# EAGLE design mono2 (EAGLE 5.11)
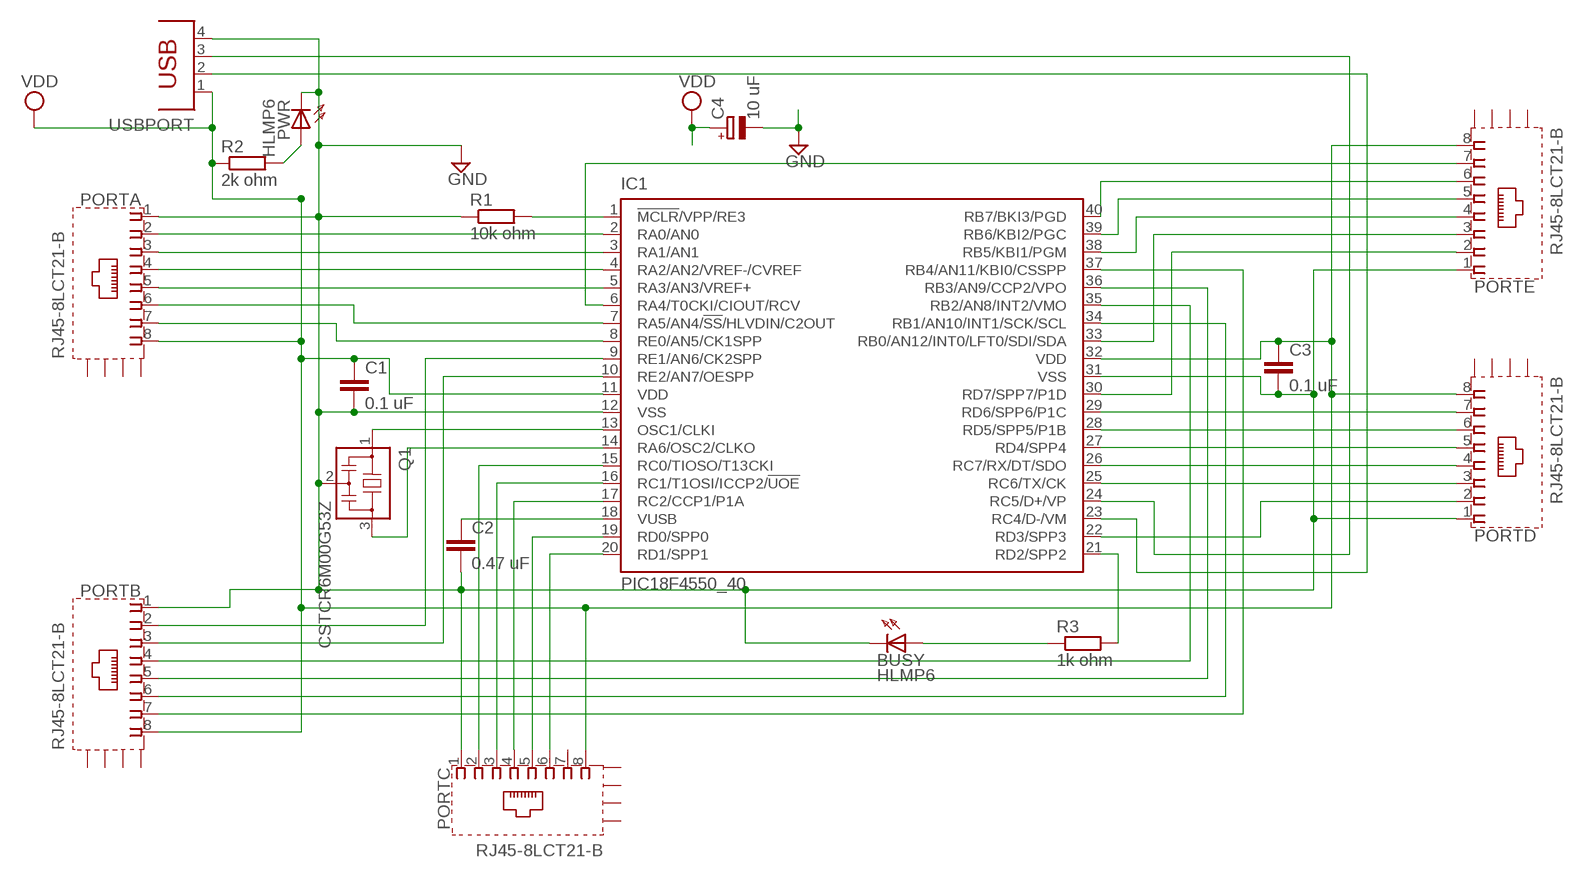
[diagram p0: schematic, sheet 1]

## Parts
BUSY  HLMP6  [HLMP6]
C1  0.1 uF  C5/3  [C5B3]
C2  0.47 uF  C5/3  [C5B3]
C3  0.1 uF  C5/3  [C5B3]
C4  10 uF  CPOL-EUE2.5-6  [E2,5-6]
IC1  PIC18F4550_40  [DIL40]
PORTA  RJ45-8LCT21-B  [RJ45-SHIELD1]
PORTB  RJ45-8LCT21-B  [RJ45-SHIELD1]
PORTC  RJ45-8LCT21-B  [RJ45-SHIELD1]
PORTD  RJ45-8LCT21-B  [RJ45-SHIELD1]
PORTE  RJ45-8LCT21-B  [RJ45-SHIELD1]
PWR  HLMP6  [HLMP6]
Q1  CSTCR6M00G53Z  [CSTCR6M]
R1  10k ohm  R-EU_0207/7  [0207/7]
R2  2k ohm  R-EU_0207/7  [0207/7]
R3  1k ohm  R-EU_0207/7  [0207/7]
USBPORT  PN61729  [PN61729]

## Nets
GND: BUSY.K C1.2 C2.2 C3.2 C4.- IC1.12(VSS) IC1.31(VSS) PORTA.1 PORTB.1 PORTC.1 PORTD.1 PORTE.1 PWR.K Q1.2 R1.1 USBPORT.4
N$1: IC1.2(RA0/AN0) PORTA.2
N$2: IC1.3(RA1/AN1) PORTA.3
N$3 [ad]: IC1.14(RA6/OSC2/CLKO) Q1.3
N$4: IC1.4(RA2/AN2/VREF-/CVREF) PORTA.4
N$5: IC1.5(RA3/AN3/VREF+) PORTA.5
N$6: IC1.29(RD6/SPP6/P1C) PORTD.7
N$7: IC1.1(!MCLR!/VPP/RE3) R1.2
N$8 [ad]: IC1.7(RA5/AN4/!SS!/HLVDIN/C2OUT) PORTA.6
N$9 [ad]: IC1.8(RE0/AN5/CK1SPP) PORTA.7
N$10 [ad]: IC1.9(RE1/AN6/CK2SPP) PORTB.2
N$11 [ad]: IC1.10(RE2/AN7/OESPP) PORTB.3
N$12 [ad]: IC1.37(RB4/AN11/KBI0/CSSPP) PORTB.7
N$14 [ad]: IC1.34(RB1/AN10/INT1/SCK/SCL) PORTB.6
N$15 [ad]: IC1.36(RB3/AN9/CCP2/VPO) PORTB.5
N$16 [ad]: IC1.35(RB2/AN8/INT2/VMO) PORTB.4
N$17: IC1.13(OSC1/CLKI) Q1.1
N$18: IC1.15(RC0/TIOSO/T13CKI) PORTC.2
N$19: IC1.17(RC2/CCP1/P1A) PORTC.4
N$20: IC1.16(RC1/T1OSI/ICCP2/!UOE) PORTC.3
N$21: IC1.20(RD1/SPP1) PORTC.6
N$22: IC1.19(RD0/SPP0) PORTC.5
N$23: C2.1 IC1.18(VUSB)
N$24: IC1.21(RD2/SPP2) R3.2
N$25: IC1.22(RD3/SPP3) PORTD.2
N$26: IC1.28(RD5/SPP5/P1B) PORTD.6
N$27: IC1.26(RC7/RX/DT/SDO) PORTD.4
N$28: IC1.27(RD4/SPP4) PORTD.5
N$29: IC1.25(RC6/TX/CK) PORTD.3
N$30: BUSY.A R3.1
N$31: IC1.30(RD7/SPP7/P1D) PORTE.2
N$32 [ad]: IC1.33(RB0/AN12/INT0/LFT0/SDI/SDA) PORTE.3
N$33: IC1.38(RB5/KBI1/PGM) PORTE.4
N$34: IC1.40(RB7/BKI3/PGD) PORTE.6
N$35: IC1.39(RB6/KBI2/PGC) PORTE.5
N$36: IC1.6(RA4/T0CKI/CIOUT/RCV) PORTE.7
N$37: IC1.23(RC4/D-/VM) USBPORT.2
N$38: IC1.24(RC5/D+/VP) USBPORT.3
N$39: PWR.A R2.2
VDD: C1.1 C3.1 C4.+ IC1.11(VDD) IC1.32(VDD) PORTA.8 PORTB.8 PORTC.8 PORTD.8 PORTE.8 R2.1 USBPORT.1
Unconnected: PORTA.S1(S) PORTA.S2(S) PORTA.S3(S) PORTA.S4(S) PORTB.S1(S) PORTB.S2(S) PORTB.S3(S) PORTB.S4(S) PORTC.7 PORTC.S1(S) PORTC.S2(S) PORTC.S3(S) PORTC.S4(S) PORTD.S1(S) PORTD.S2(S) PORTD.S3(S) PORTD.S4(S) PORTE.S1(S) PORTE.S2(S) PORTE.S3(S) PORTE.S4(S)

## Library data of the parts
BUSY PWR = display-hp:HLMP6: LED 2mm horizontal; MF: AGILENT TECHNOLOGIES; MPN: HLMP-6500; OC_FARNELL: 1652490; OC_NEWARK: 40K0088
C1-C3 = capacitor-wima:C: CAPACITOR naming: grid - package width
C4 = rcl:CPOL-EU: POLARIZED CAPACITOR, European symbol
IC1 = microchip:PIC18F4*_40: USB Microcontrollers with nanoWatt Technology High-Performance, Enhanced Flash, 28/40/44-Pin, Source: http://ww1.microchip.com/downloads/en/devicedoc/39632c.pdf; MF: MICROCHIP; MPN: PIC18F4550-I/P; OC_FARNELL: 9321357; OC_NEWARK: 74K8623
PORTA PORTB PORTC PORTD PORTE = con-tycoelectronics:RJ45*2: RJ45 Low Profile Shield Type 2 For all RJ45 L, LC, LCT and X Series Models Source: www.tycoelectronics.com .. ENG_DS_1654001_1099_RJ_L_0507.pdf; OC_FARNELL: unknown; OC_NEWARK: unknown
Q1 = murata-filter:CSTCR: Resonator Source: murata.co.jp; MPN: CSTCR6M00G53-R0; OC_FARNELL: 1170434; OC_NEWARK: 25M8759
R1 R3 = rcl:R-EU_: RESISTOR, European symbol
R2 = resistor:R-EU_: RESISTOR, European symbol
USBPORT = con-berg:PN61729: BERG USB connector; OC_FARNELL: unknown; OC_NEWARK: unknown

## Net classes
0 default: width 0.203 mm
1 pwr: width 0.203 mm
2 ad: width 0.203 mm

## Board
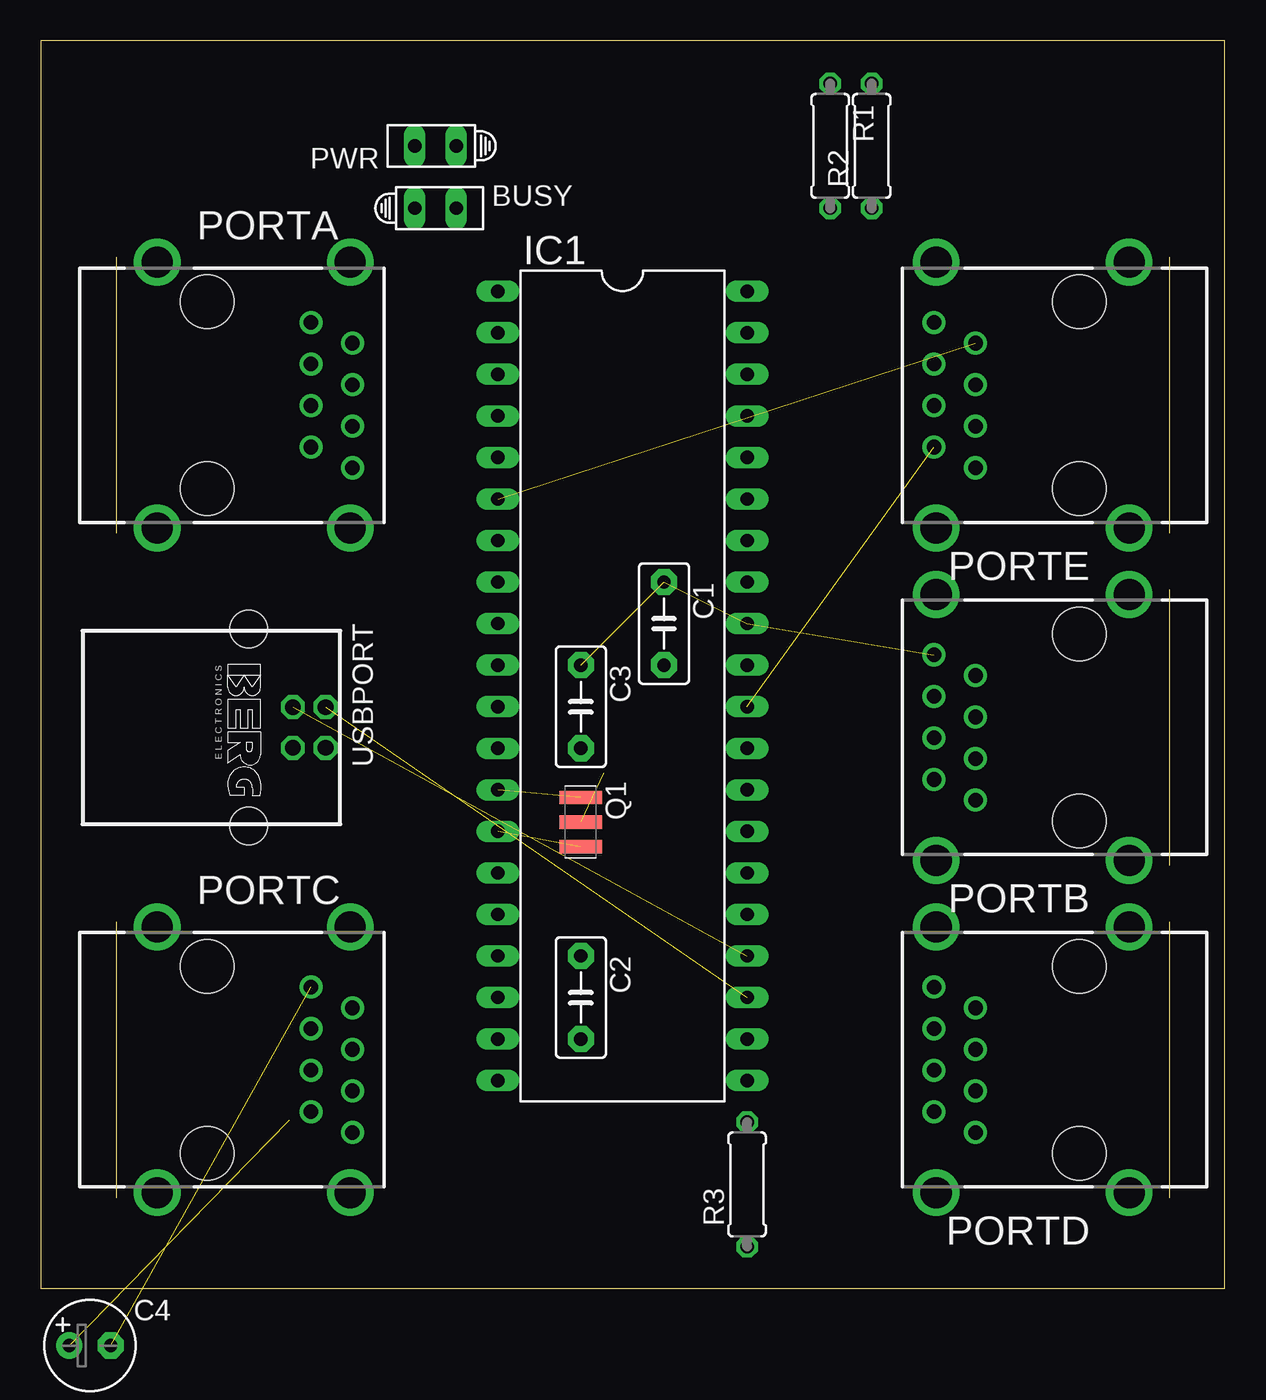
[diagram p1: board, top side]
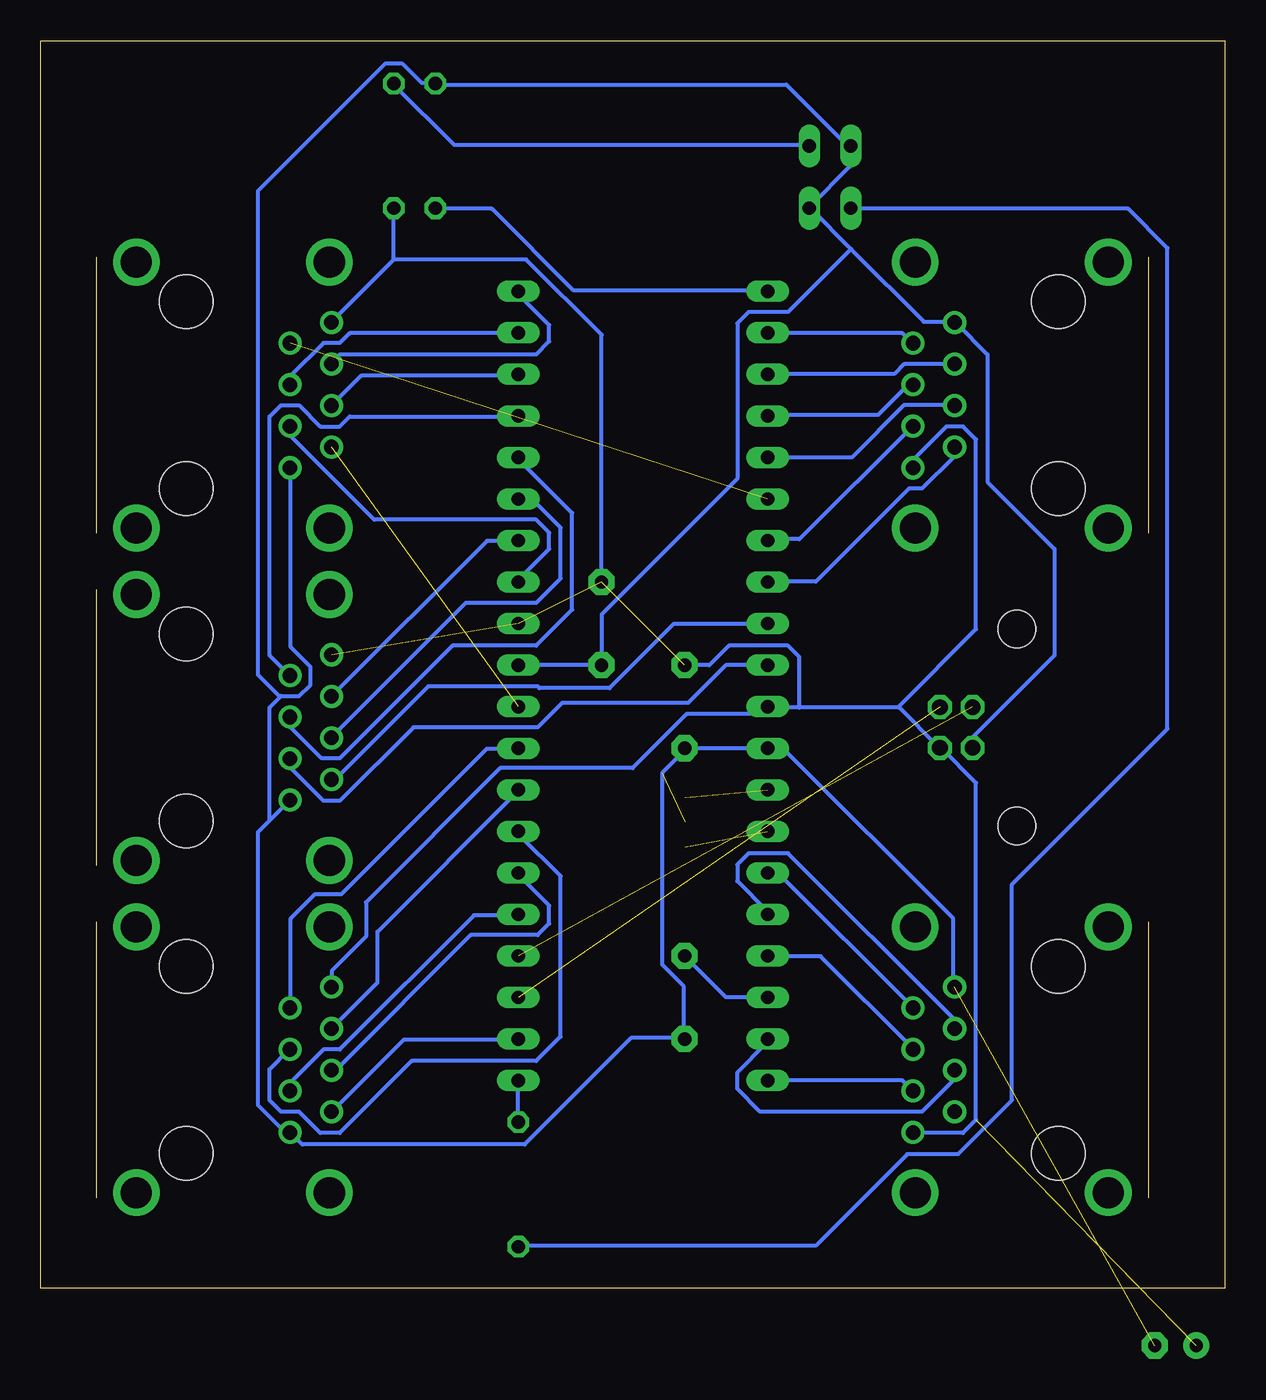
[diagram p2: board, bottom side, seen from below]

Size 72.38 x 76.27 mm. Coordinates in mm from the lower left corner, seen from the top.
Outline: 0,0 72.38,0 72.38,76.27 0,76.27 0,0
Copper layers (1*16): Top 0.035mm / dielectric 1.5mm / Bottom 0.035mm
Design rules "default *": minimum track width 10mil, minimum drill 24mil, track to track 16mil, track to pad 16mil, pad to pad 16mil, via to via 16mil, smd to smd 8mil, copper to edge 40mil, drill to drill 8mil, minimum pad ring 10mil, minimum via ring 8mil, stop-mask expansion 4mil, vias tented up to drill 0mil, thermal gap 10mil

### Footprints (pad centres in the part's own frame; a part is rotated, then mirrored left to right if it is on the bottom)
HLMP6 = drill 0.813 long: A -1.27,0; K 1.27,0
C5B3 = drill 0.813 pad 1.6 octagon: 1 -2.54,0; 2 2.54,0
E2,5-6 = drill 0.813 pad 1.6 round: + -1.27,0 | drill 0.813 pad 1.6 octagon: - 1.27,0
DIL40 = drill 0.813 long: 1 -24.13,-7.62; 2 -21.59,-7.62; 3 -19.05,-7.62; 4 -16.51,-7.62; 5 -13.97,-7.62; 6 -11.43,-7.62; 7 -8.89,-7.62; 8 -6.35,-7.62; 9 -3.81,-7.62; 10 -1.27,-7.62; 11 1.27,-7.62; 12 3.81,-7.62; 13 6.35,-7.62; 14 8.89,-7.62; 15 11.43,-7.62; 16 13.97,-7.62; 17 16.51,-7.62; 18 19.05,-7.62; 19 21.59,-7.62; 20 24.13,-7.62; 21 24.13,7.62; 22 21.59,7.62; 23 19.05,7.62; 24 16.51,7.62; 25 13.97,7.62; 26 11.43,7.62; 27 8.89,7.62; 28 6.35,7.62; 29 3.81,7.62; 30 1.27,7.62; 31 -1.27,7.62; 32 -3.81,7.62; 33 -6.35,7.62; 34 -8.89,7.62; 35 -11.43,7.62; 36 -13.97,7.62; 37 -16.51,7.62; 38 -19.05,7.62; 39 -21.59,7.62; 40 -24.13,7.62
RJ45-SHIELD1 = drill 0.9 pad 1.4 round: 1 -4.445,6.35; 2 -3.175,8.89; 3 -1.905,6.35; 4 -0.635,8.89; 5 0.635,6.35; 6 1.905,8.89; 7 3.175,6.35; 8 4.445,8.89 | drill 1.9 pad 2.5 round: S1 -8.128,-3.048; S2 8.128,-3.048; S3 -8.128,8.76; S4 8.128,8.76 | hole 3.251: -5.715,0; 5.715,0
CSTCR6M = smd 0.8 x 2.6: 1 -1.5,0; 2 0,0; 3 1.5,0
0207/7 = drill 0.813 octagon: 1 -3.81,0; 2 3.81,0
PN61729 = drill 0.95 octagon: 1 1.25,4.71; 2 -1.25,4.71; 3 -1.25,2.71; 4 1.25,2.71 | hole 2.3: -6.02,0; 6.02,0

### Placement (x,y rotation side)
BUSY  24.13,66.04 0 top
C1  38.1,40.64 270 top
C2  33.02,17.78 270 top
C3  33.02,35.56 270 top
C4  3,-3.5 0 top  (outside the outline)
IC1  35.56,36.83 270 top
PORTA  10.16,54.61 270 top
PORTB  63.5,34.29 90 top
PORTC  10.16,13.97 270 top
PORTD  63.5,13.97 90 top
PORTE  63.5,54.61 90 top
PWR  24.13,69.85 180 top
Q1  33,28.5 270 top
R1  48.26,69.85 270 top
R2  50.8,69.85 90 top
R3  43.18,6.35 90 top
USBPORT  12.7,34.29 270 top

### Tracks (layer width: path | path; a pad name or v marks a point on that pad's centre or on a via)
GND  (2 unrouted)
  Bottom 0.254: IC1.31 C1.2 38.1,41.2 29.8,49.5 29.8,59 29.1,59.7 26.7,59.7 22.85,63.55 | 22.85,63.55 25.3,66 BUSY.K 25.4,66.1 22.9,68.6 22.9,69.8 PWR.K 23,69.8 26.8,73.6 48.2,73.6 R1.1 48.3,73.7 49.1,73.7 50.3,74.9 51.3,74.9 59.1,67.1 59.1,37.5 57.8,36.2 57.7,36.2 | 22.85,63.55 18.4,59.1 16.6,59.1 PORTA.1 16.4,59 14.5,57.1 14.5,49.3 10.4,45.2 10.4,38.7 15.4,33.7 15.4,33.1 USBPORT.4 | PORTC.1 16.6,18.5 16.6,22.6 26.9,32.9 27.9,32.9 IC1.12 28,33 33,33 C3.2 33,32.9 34.4,31.5 34.4,19.8 33.1,18.5 33.1,15.3 C2.2 33.2,15.3 36.3,15.3 42.8,8.8 56.4,8.8 57.1,9.5 PORTD.1 57.2,9.6 57.5,9.6 59.1,11.2 59.1,27.9 58.35,28.65 | 58.35,28.65 57.2,29.8 PORTB.1 | 57.7,36.2 56.6,36.2 55.9,36.9 55.9,38 57.1,39.2 57.1,50.1 PORTE.1 | 57.7,36.2 58.4,35.5 58.4,28.7 58.35,28.65
N$1
  Bottom 0.254: IC1.2 27.9,58.4 19.7,58.4 19.1,57.8 PORTA.2
N$2
  Bottom 0.254: IC1.3 27.9,55.9 20.2,55.9 19.6,56.5 16.6,56.5 PORTA.3
N$3  (1 unrouted)
N$4
  Bottom 0.254: IC1.4 27.9,53.4 21.2,53.4 19.4,55.2 19.1,55.2 PORTA.4
N$5
  Bottom 0.254: IC1.5 22.8,50.8 19.6,54 16.6,54 PORTA.5
N$6
  Bottom 0.254: IC1.29 43.2,33 45.1,33 54,24.1 55.6,24.1 57.1,22.6 57.1,17.2 PORTD.7
N$7
  Bottom 0.254: IC1.1 28,61 39.8,61 44.8,66 48.2,66 R1.2
N$8
  Bottom 0.254: IC1.7 27.9,45.8 26,45.8 19.1,52.7 PORTA.6
N$9
  Bottom 0.254: IC1.8 27.9,43.2 25,43.2 19.3,48.9 18.5,48.9 16.6,50.8 16.6,51.4 PORTA.7
N$10
  Bottom 0.254: IC1.9 28,40.6 33.7,40.6 37.6,36.7 41.9,36.7 42,36.8 48.7,36.8 54.3,31.2 54.6,31.2 PORTB.2
N$11
  Bottom 0.254: IC1.10 30.5,38.1 32.8,35.8 40.5,35.8 42,34.3 49.6,34.3 54.1,29.8 55.1,29.8 57.1,31.8 57.1,32.3 PORTB.3
N$12
  Bottom 0.254: IC1.37 43.2,53.3 53.5,53.3 54.1,52.7 55.3,52.7 56.6,54 57.7,54 58.4,53.3 58.4,38.7 57.2,37.5 PORTB.7
N$14
  Bottom 0.254: IC1.34 43.2,45.7 45.1,45.7 PORTB.6
N$15
  Bottom 0.254: IC1.36 43.1,50.8 43.1,50.6 39.9,47.4 39.9,41.5 42.1,39.3 47.2,39.3 54.1,32.4 55.2,32.4 57.1,34.3 57.1,34.9 PORTB.5
N$16
  Bottom 0.254: IC1.35 43.1,48.2 42.3,48.2 40.6,46.5 40.6,43.4 42.1,41.9 46.4,41.9 54.6,33.7 PORTB.4
N$17  (1 unrouted)
N$18
  Bottom 0.254: IC1.15 27.3,25.4 19.1,17.2 PORTC.2
N$19
  Bottom 0.254: IC1.17 27.9,20.3 24.7,20.3 19.1,14.7 PORTC.4
N$20
  Bottom 0.254: IC1.16 28,22.9 28,23.1 29.8,24.9 29.8,25.9 29.1,26.6 26.7,26.6 16.6,16.5 16.6,15.9 PORTC.3
N$21
  Bottom 0.254: IC1.20 19.7,12.7 19.1,12.1 PORTC.6
N$22
  Bottom 0.254: IC1.19 28,15.2 28,15 29.8,13.2 29.8,12.2 28.4,10.8 18.5,10.8 16.6,12.7 16.6,13.3 PORTC.5
N$23
  Bottom 0.254: IC1.18 28,17.8 30.5,17.8 C2.1
N$24
  Bottom 0.254: R3.2 43.2,10.2 43.2,12.7 IC1.21
N$25
  Bottom 0.254: IC1.22 43.2,15.2 50.2,15.2 PORTD.2
N$26
  Bottom 0.254: IC1.28 43.2,30.4 51.8,21.8 51.8,18.7 54.6,15.9 PORTD.6
N$27
  Bottom 0.254: IC1.26 43.1,25.4 43.1,25.2 41.3,23.4 41.3,22.3 42,21.6 46.1,21.6 54.3,13.4 54.6,13.4 PORTD.4
N$28
  Bottom 0.254: IC1.27 43.1,27.9 43.1,27.7 40.6,25.2 40.6,15.4 42.1,13.9 49.7,13.9 54.1,9.5 55.3,9.5 56.6,10.8 57.7,10.8 58.4,11.5 58.4,13.4 57.2,14.6 PORTD.5
N$29
  Bottom 0.254: IC1.25 43.2,22.8 45.9,22.8 54.1,14.6 55.1,14.6 57.1,12.6 57.1,12.1 PORTD.3
N$30
  Bottom 0.254: R3.1 43.1,2.6 25,2.6 19.4,8.2 16.3,8.2 13,11.5 13,24.7 3.5,34.2 3.5,63.6 5.9,66 22.8,66 BUSY.A
N$31  (1 unrouted)
N$32
  Bottom 0.254: IC1.33 43.1,43.2 43.1,43.4 41.3,45.2 41.3,46.2 42.1,47 52,47 57.1,52.1 57.1,52.7 PORTE.3
N$33
  Bottom 0.254: IC1.38 43.2,55.8 52.8,55.8 54.6,54 PORTE.4
N$34
  Bottom 0.254: IC1.40 43.1,60.9 43.1,60.7 41.3,58.9 41.3,57.9 42.1,57.1 54.1,57.1 54.6,56.6 PORTE.6
N$35
  Bottom 0.254: IC1.39 43.2,58.4 53.5,58.4 54.1,57.8 55.1,57.8 57.1,55.8 57.1,55.3 PORTE.5
N$36  (1 unrouted)
N$37  (1 unrouted)
N$38  (1 unrouted)
N$39
  Bottom 0.254: PWR.A 25.4,69.9 47.1,69.9 50.8,73.6 R2.2
VDD  (4 unrouted)
  Bottom 0.254: 50.8,62.9 54.6,59.1 PORTE.8 | 50.8,62.9 R2.1 | C1.1 38.1,58.3 42.7,62.9 50.8,62.9 | 19.9,35.5 26,35.5 | 26,35.5 27.9,35.5 IC1.11 28.4,35.1 32.9,35.1 36.2,31.8 44.3,31.8 52.5,23.6 52.5,21.5 54.6,19.4 54.6,18.5 PORTD.8 | 19.9,35.5 17.5,33.1 USBPORT.1 17.3,33 15.2,30.9 15.2,10.3 16,9.5 19,9.5 PORTC.8 | PORTA.8 19,50.2 19,50.7 17,52.7 16,52.7 15.2,51.9 15.2,40.3 19.9,35.6 19.9,35.5 | C3.1 31.5,38.1 30.3,39.3 26.7,39.3 26,38.6 26,35.5